# Altium schematic sheet AMP.SchDoc
size A4
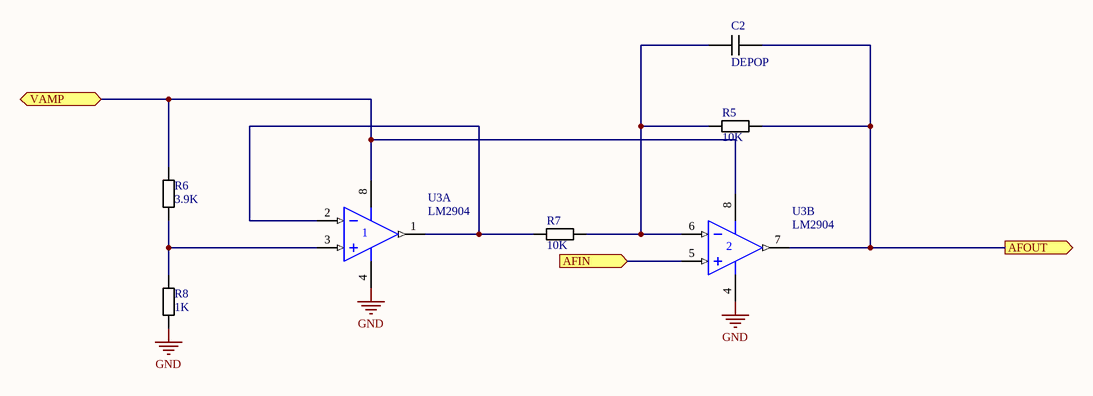
[diagram p0: AMP.SchDoc]

## Parts
C2  value DEPOP  [0805 Cap]  (hidden comment: 0805 Cap)
R5  value 10K  [0805 Resistor]  (hidden comment: 0805 Resistor)
R6  value 3.9K  [0805 Resistor]  (hidden comment: 0805 Resistor)
R7  value 10K  [0805 Resistor]  (hidden comment: 0805 Resistor)
R8  value 1K  [0805 Resistor]  (hidden comment: 0805 Resistor)
U3  LM2904  [SOIC8 - LT1120A]  (parts A,B of 2)

## Ports
AFIN (in), AFOUT (out), VAMP

## Nets
GND: R8.1 U3.4(V+)
AFIN: U3.5(IN+) ; port AFIN
AFOUT: C2.2 R5.2 U3.7(OUT) ; port AFOUT
VAMP: R6.1 U3.8(V+) ; port VAMP
NetC2_1: C2.1 R5.1 R7.2 U3.6(IN-)
NetR6_2: R6.2 R8.2 U3.3(IN+)
NetR7_1: R7.1 U3.1(OUT) U3.2(IN-)

## Library data of the parts
C2 = 0805 MLCC - NP0, 5%
R5-R8 = 0805 Thick Film Resistor 1%
U3 = LM2904: Dual Operational Amplifier; Supplier: Element 14; Supplier P/N: 1564750